# EAGLE design Arduino EPROM Reader (EAGLE 6.5.0)
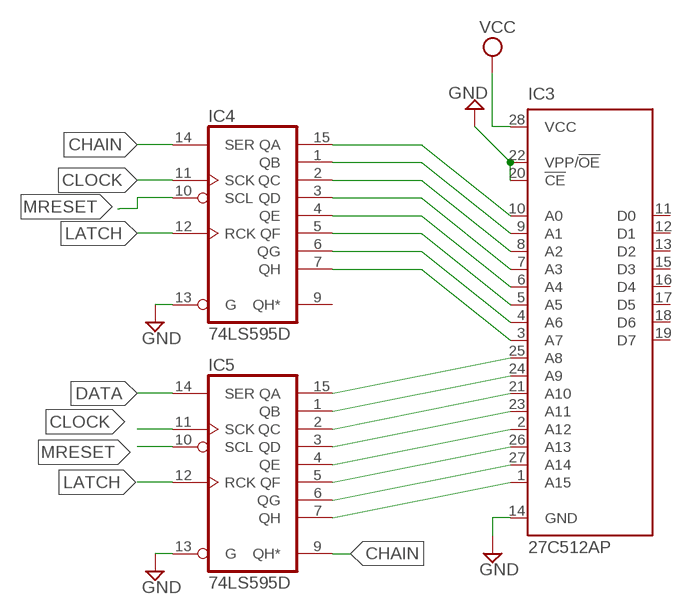
[diagram p0: schematic, sheet 1]

## Parts
IC3  27C512AP  [DIL28-6]
IC4  74LS595D  [SO16]
IC5  74LS595D  [SO16]

## Nets
CHAIN: IC4.14(SER) IC5.9(QH*)
CLOCK: IC4.11(SCK) IC5.11(SCK)
DATA: IC5.14(SER)
GND: IC3.14(GND) IC3.20(!CE) IC3.22(VPP/!OE) IC4.13(G) IC5.13(G)
LATCH: IC4.12(RCK) IC5.12(RCK)
MRESET: IC4.10(SCL) IC5.10(SCL)
N$1: IC3.10(A0) IC4.15(QA)
N$2: IC3.9(A1) IC4.1(QB)
N$3: IC3.8(A2) IC4.2(QC)
N$4: IC3.7(A3) IC4.3(QD)
N$5: IC3.6(A4) IC4.4(QE)
N$6: IC3.5(A5) IC4.5(QF)
N$7: IC3.4(A6) IC4.6(QG)
N$8: IC3.3(A7) IC4.7(QH)
N$10: IC3.25(A8) IC5.15(QA)
N$11: IC3.24(A9) IC5.1(QB)
N$12: IC3.21(A10) IC5.2(QC)
N$13: IC3.23(A11) IC5.3(QD)
N$14: IC3.2(A12) IC5.4(QE)
N$16: IC3.26(A13) IC5.5(QF)
N$17: IC3.27(A14) IC5.6(QG)
N$18: IC3.1(A15) IC5.7(QH)
VCC: IC3.28(VCC)
Unconnected: IC3.11(D0) IC3.12(D1) IC3.13(D2) IC3.15(D3) IC3.16(D4) IC3.17(D5) IC3.18(D6) IC3.19(D7) IC4.9(QH*)

## Power pins joined to a net without a drawn wire
GND: IC4.8(GND) IC5.8(GND)
VCC: IC4.16(VCC) IC5.16(VCC)

## Library data of the parts
IC3 = microchip:27*512A: CMOS EPROM 512 K (64 K x 8); MPN: M27C512-90B6; OC_FARNELL: 1642690; OC_NEWARK: 20M6389
IC4 IC5 = 74xx-us:74*595: 8-bit SHIFT REGISTER, output latch

## Board
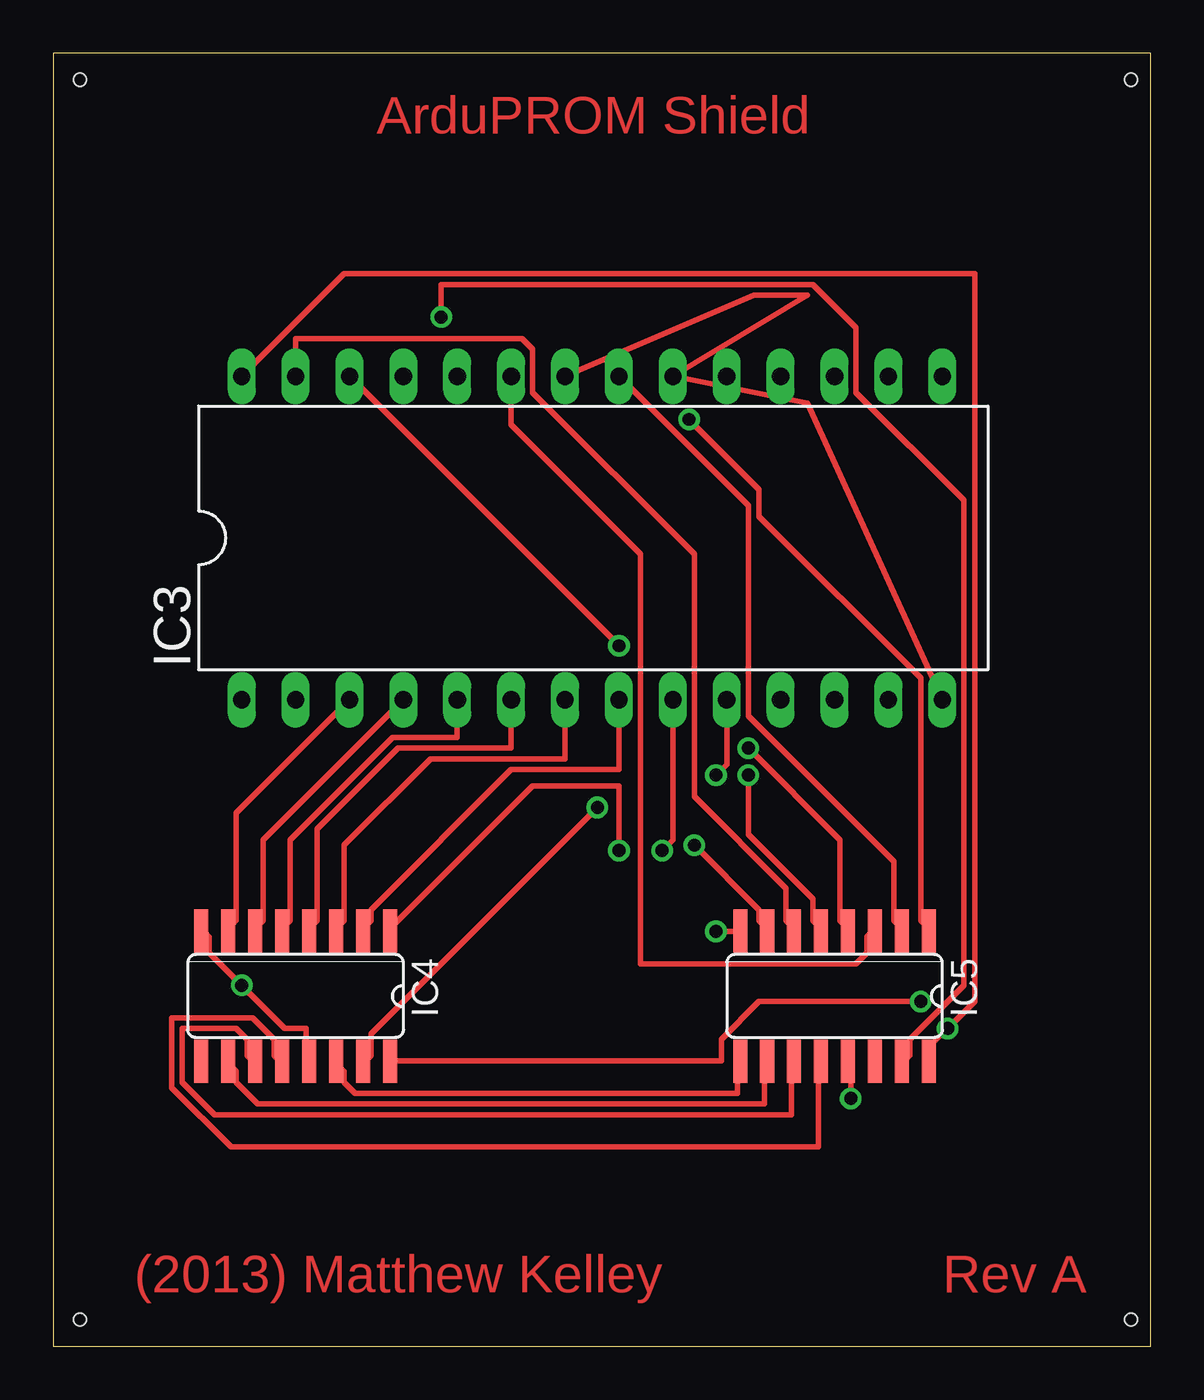
[diagram p1: board, top side]
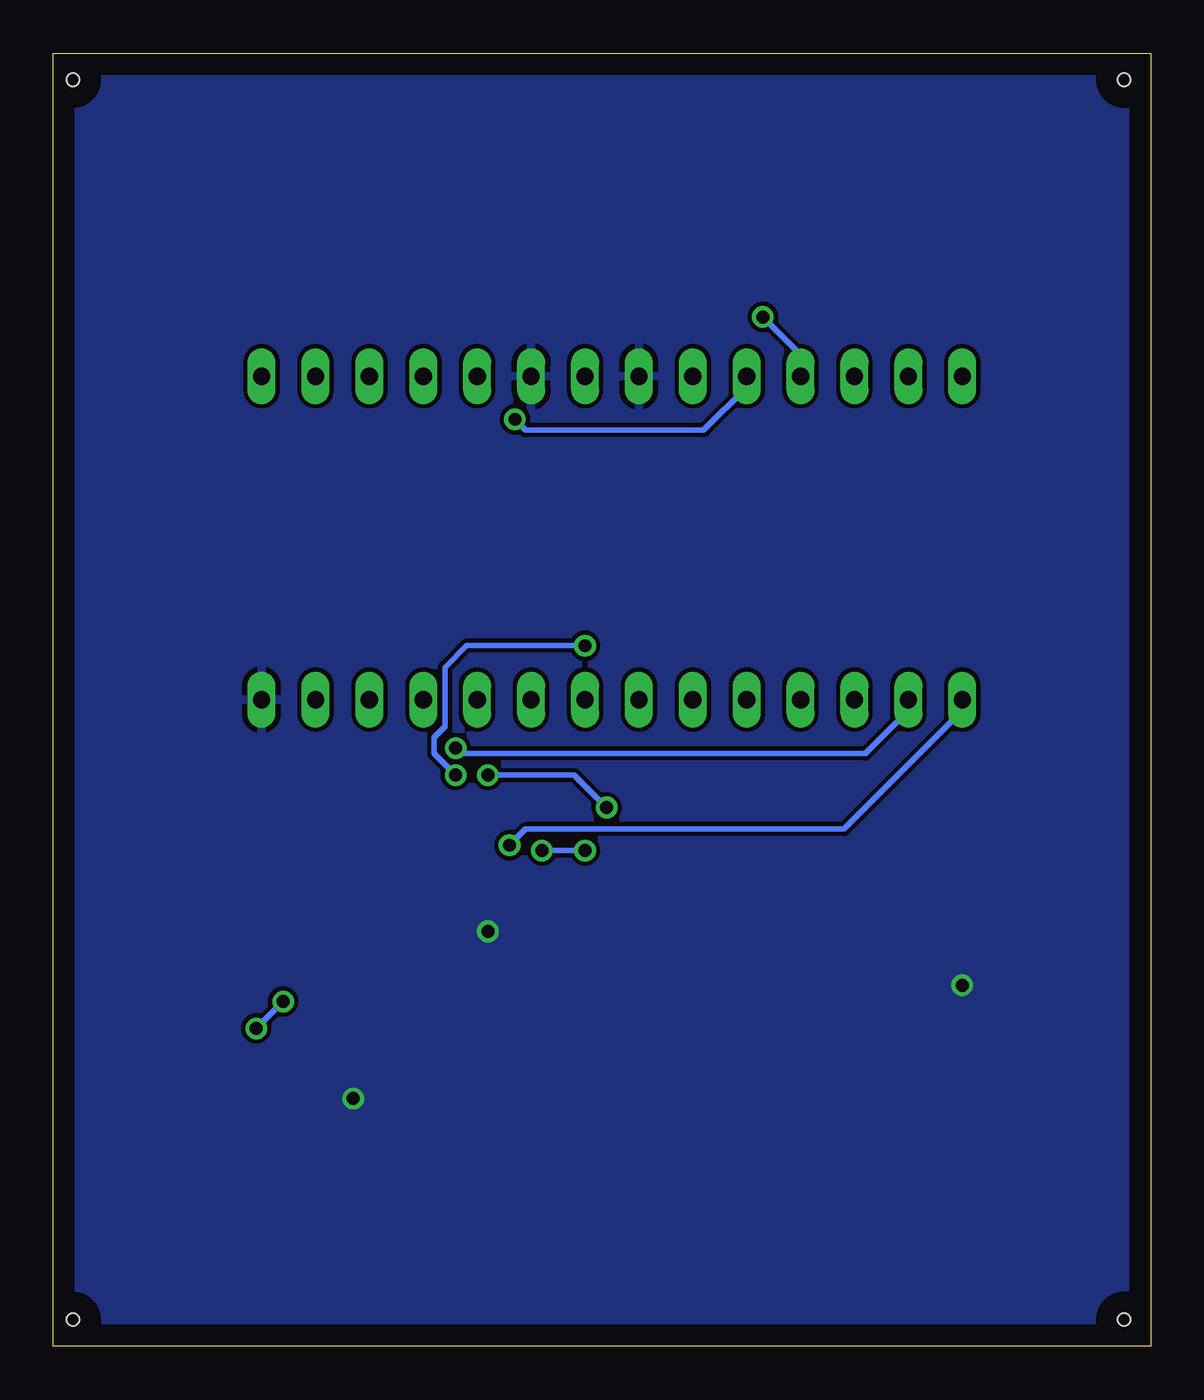
[diagram p2: board, bottom side, seen from below]

Size 51.74 x 60.95 mm. Coordinates in mm from the lower left corner, seen from the top.
Outline: 0,0 51.74,0 51.74,60.95 0,60.95 0,0
Copper layers (1*16): Top 0.035mm / dielectric 1.5mm / Bottom 0.035mm
Design rules "default": minimum track width 10mil, minimum drill 24mil, track to track 8mil, track to pad 8mil, pad to pad 8mil, via to via 8mil, smd to smd 8mil, copper to edge 40mil, drill to drill 8mil, minimum pad ring 10mil, minimum via ring 8mil, stop-mask expansion 4mil, vias tented up to drill 0mil, thermal gap 10mil
Holes 0.6 mm at 1.27,59.69 50.8,59.69 50.8,1.27 1.27,1.27

### Footprints (pad centres in the part's own frame; a part is rotated, then mirrored left to right if it is on the bottom)
DIL28-6 = drill 0.813 long: 1 -16.51,-7.62; 2 -13.97,-7.62; 3 -11.43,-7.62; 4 -8.89,-7.62; 5 -6.35,-7.62; 6 -3.81,-7.62; 7 -1.27,-7.62; 8 1.27,-7.62; 9 3.81,-7.62; 10 6.35,-7.62; 11 8.89,-7.62; 12 11.43,-7.62; 13 13.97,-7.62; 14 16.51,-7.62; 15 16.51,7.62; 16 13.97,7.62; 17 11.43,7.62; 18 8.89,7.62; 19 6.35,7.62; 20 3.81,7.62; 21 1.27,7.62; 22 -1.27,7.62; 23 -3.81,7.62; 24 -6.35,7.62; 25 -8.89,7.62; 26 -11.43,7.62; 27 -13.97,7.62; 28 -16.51,7.62
SO16 = smd 0.66 x 2.032: 1 -4.445,-3.073; 2 -3.175,-3.073; 3 -1.905,-3.073; 4 -0.635,-3.073; 5 0.635,-3.073; 6 1.905,-3.073; 7 3.175,-3.073; 8 4.445,-3.073; 9 4.445,3.073; 10 3.175,3.073; 11 1.905,3.073; 12 0.635,3.073; 13 -0.635,3.073; 14 -1.905,3.073; 15 -3.175,3.073; 16 -4.445,3.073

### Placement (x,y rotation side)
IC3  25.4,38.1 0 top
IC4  11.43,16.51 180 top
IC5  36.83,16.51 180 top

### Tracks (layer width: path | path; a pad name or v marks a point on that pad's centre or on a via)
CHAIN
  Top 0.254: IC4.14 13.46,13.21 13.72,12.95 13.72,12.45 14.22,11.94 32.26,11.94 32.26,13.21 IC5.9
CLOCK
  Top 0.254: IC4.11 9.4,13.46 9.14,13.72 9.14,14.48 8.64,14.99 6.1,14.99 6.1,12.45 7.62,10.92 34.8,10.92 34.8,13.21 IC5.11
GND  (via drill 0.61)
  Top 0.254: IC3.22 33.02,49.53 35.56,49.53 IC3.20 35.56,44.45 IC3.14 | IC4.8 7.11,19.56 7.37,19.3 7.37,18.54 v8.89,17.02 10.92,14.99 11.94,14.99 11.94,13.46 IC4.13 | v31.24,19.56 32.26,19.56 IC5.8 | v37.59,11.68 37.59,13.21 IC5.13
  pour Bottom: -1.27,62.23 -1.27,-1.27 53.34,-1.27 53.34,62.23
LATCH
  Top 0.254: IC4.12 10.67,13.46 10.41,13.72 10.41,14.48 9.4,15.49 5.59,15.49 5.59,12.19 8.38,9.4 36.07,9.4 36.07,13.21 IC5.12
MRESET
  Top 0.254: IC4.10 8.38,13.21 8.64,12.95 8.64,12.45 9.65,11.43 33.53,11.43 33.53,13.21 IC5.10
N$1  (via drill 0.61)
  Top 0.254: v25.65,25.4 14.99,14.73 14.99,13.72 14.73,13.46 IC4.15 | v31.24,26.92 31.75,27.43 IC3.10
  Bottom 0.254: v25.65,25.4 27.18,26.92 v31.24,26.92
N$2  (via drill 0.61)
  Top 0.254: v26.67,23.37 26.67,26.42 22.61,26.42 16,19.81 IC4.1 | v28.7,23.37 29.21,23.88 IC3.9
  Bottom 0.254: v28.7,23.37 v26.67,23.37
N$3
  Top 0.254: IC3.8 26.67,27.18 21.59,27.18 14.99,20.57 14.99,20.07 14.73,19.81 IC4.2
N$4
  Top 0.254: IC3.7 24.13,27.69 17.78,27.69 13.72,23.62 13.72,20.07 13.46,19.81 IC4.3
N$5
  Top 0.254: IC3.6 21.59,28.19 16.26,28.19 12.45,24.38 12.45,20.07 12.19,19.81 IC4.4
N$6
  Top 0.254: IC3.5 19.05,28.7 16,28.7 11.18,23.88 11.18,20.07 10.92,19.81 IC4.5
N$7
  Top 0.254: IC3.4 9.91,23.88 9.91,20.07 9.65,19.81 IC4.6
N$8
  Top 0.254: IC3.3 8.64,25.15 8.64,20.07 8.38,19.81 IC4.7
N$10  (via drill 0.61)
  Top 0.254: v18.29,48.51 18.29,50.04 35.81,50.04 37.85,48.01 37.85,44.96 42.93,39.88 42.93,17.02 40.39,14.48 40.39,13.72 40.13,13.46 IC5.15
  Bottom 0.254: v18.29,48.51 16.51,46.74 IC3.25
N$11  (via drill 0.61)
  Top 0.254: v29.97,43.69 33.27,40.39 33.27,39.12 40.89,31.5 40.89,20.07 41.15,19.81 IC5.1
  Bottom 0.254: v29.97,43.69 29.46,43.18 21.08,43.18 19.05,45.21 IC3.24
N$12
  Top 0.254: IC3.21 32.77,39.62 32.77,29.72 39.62,22.86 39.62,20.07 39.88,19.81 IC5.2
N$13
  Top 0.254: IC3.23 21.59,43.43 27.69,37.34 27.69,18.03 37.85,18.03 38.35,18.54 38.35,19.3 38.61,19.56 IC5.3
N$14  (via drill 0.61)
  Top 0.254: v32.77,28.19 37.08,23.88 37.08,20.07 37.34,19.81 IC5.4
  Bottom 0.254: v32.77,28.19 32.51,27.94 13.46,27.94 11.43,29.97 IC3.2
N$16  (via drill 0.61)
  Top 0.254: v32.77,26.92 32.77,24.13 35.81,21.08 35.81,20.07 36.07,19.81 IC5.5 | IC3.26 v26.67,33.02
  Bottom 0.254: v32.77,26.92 33.78,27.94 33.78,28.7 33.27,29.21 33.27,32 32.26,33.02 v26.67,33.02
N$17
  Top 0.254: IC3.27 11.43,47.5 22.1,47.5 22.61,46.99 22.61,44.96 30.23,37.34 30.23,25.91 34.54,21.59 34.54,20.07 34.8,19.81 IC5.6
N$18  (via drill 0.61)
  Top 0.254: v30.23,23.62 33.27,20.57 33.27,20.07 33.53,19.81 IC5.7
  Bottom 0.254: v30.23,23.62 29.46,24.38 14.48,24.38 8.89,29.97 IC3.1
VCC  (via drill 0.61)
  Top 0.254: v40.89,16.26 33.27,16.26 31.5,14.48 31.5,13.46 16,13.46 IC4.16 | IC5.16 41.4,13.46 41.4,14.22 v42.16,14.99 43.43,16.26 43.43,50.55 13.72,50.55 IC3.28
  Bottom 0.254: v42.16,14.99 v40.89,16.26

### Text on the board
Top: ArduPROM Shield | (2013) Matthew Kelley | Rev A